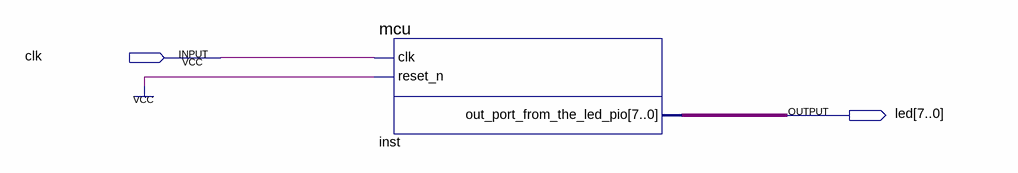
[diagram p0: schematic sheet]
// Quartus schematic led_test.bdf as structural Verilog: 1 symbols, 2 pins
module led_test (
  input  clk,
  output [7:0] led
);

  mcu inst (.clk(clk), .reset_n(1'b1), .out_port_from_the_led_pio(led));
endmodule
